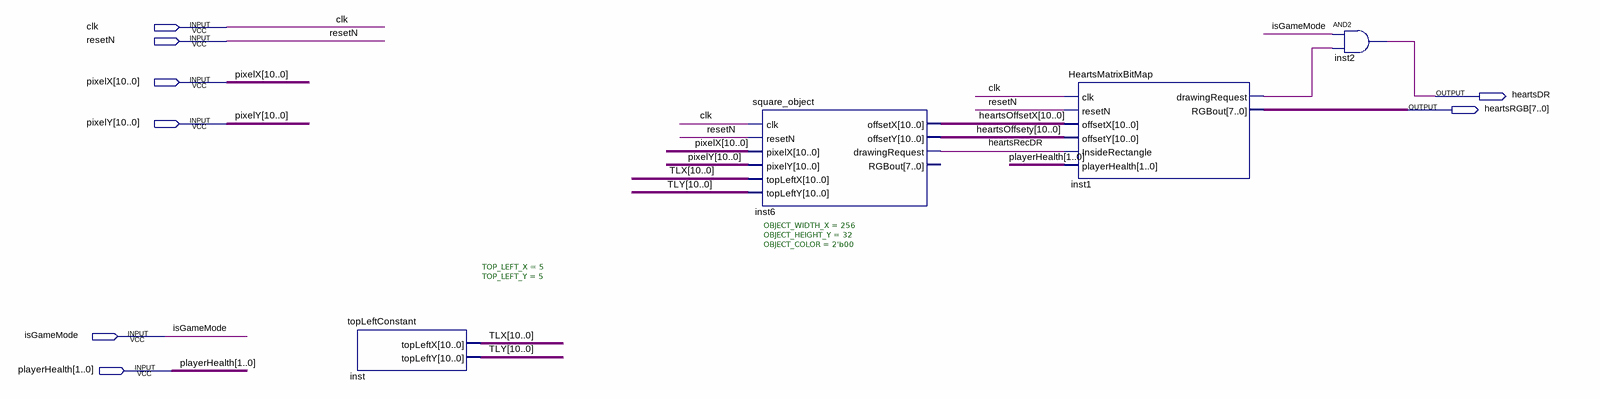
[diagram p0: schematic sheet]
// Quartus schematic HeartsDisplay.bdf as structural Verilog: 4 symbols, 8 pins
module HeartsDisplay (
  input  clk,
  input  resetN,
  input  [10:0] pixelX,
  input  [10:0] pixelY,
  input  isGameMode,
  input  [1:0] playerHealth,
  output heartsDR,
  output [7:0] heartsRGB
);

  wire heartsRecDR, inst1_drawingrequest;
  wire [10:0] heartsOffsetX, heartsOffsety, TLX, TLY;

  topLeftConstant #(.TOP_LEFT_X(5), .TOP_LEFT_Y(5)) inst (.topLeftX(TLX), .topLeftY(TLY));
  square_object #(.OBJECT_WIDTH_X(256), .OBJECT_HEIGHT_Y(32), .OBJECT_COLOR(2'b00)) inst6 (
    .clk(clk), .resetN(resetN), .pixelX(pixelX), .pixelY(pixelY), .topLeftX(TLX), .topLeftY(TLY),
    .offsetX(heartsOffsetX), .offsetY(heartsOffsety), .drawingRequest(heartsRecDR));  // open: RGBout
  HeartsMatrixBitMap inst1 (
    .clk(clk), .resetN(resetN), .offsetX(heartsOffsetX), .offsetY(heartsOffsety),
    .InsideRectangle(heartsRecDR), .playerHealth(playerHealth), .drawingRequest(inst1_drawingrequest),
    .RGBout(heartsRGB));
  and inst2 (heartsDR, isGameMode, inst1_drawingrequest);
endmodule
